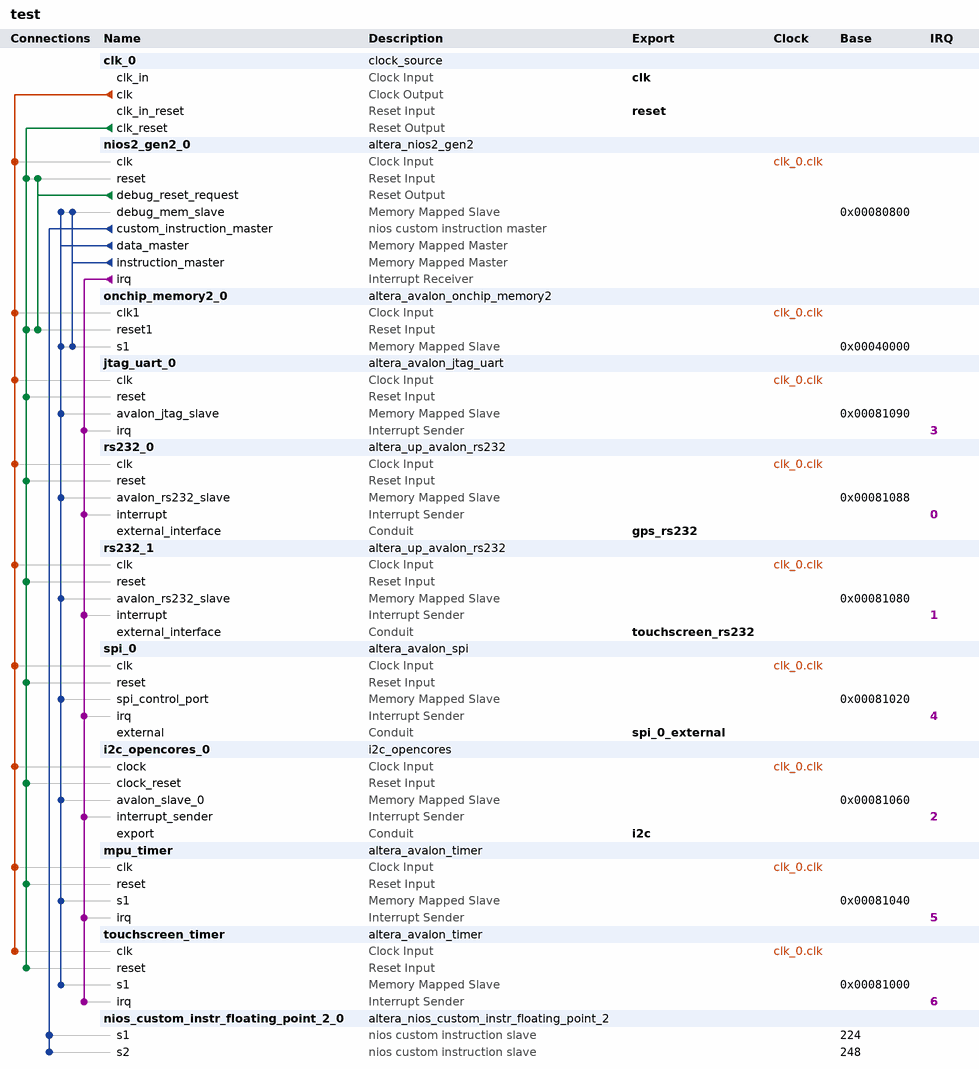
[diagram p0: system contents]
# Platform Designer (Qsys) system test, Cyclone V 5CSEMA5F31C6
# Parameters at their usual value, and those the tool derives, are not listed.
package require -exact qsys 18.1
create_system test
set_project_property DEVICE_FAMILY {Cyclone V}
set_project_property DEVICE 5CSEMA5F31C6

add_instance clk_0 clock_source 18.1
set_instance_parameter_value clk_0 clockFrequency 50000000

add_instance nios2_gen2_0 altera_nios2_gen2 18.1
set_instance_parameter_value nios2_gen2_0 dcache_size 2048
set_instance_parameter_value nios2_gen2_0 exceptionSlave onchip_memory2_0.s1
set_instance_parameter_value nios2_gen2_0 icache_size 4096
set_instance_parameter_value nios2_gen2_0 impl Tiny
set_instance_parameter_value nios2_gen2_0 resetSlave onchip_memory2_0.s1

add_instance onchip_memory2_0 altera_avalon_onchip_memory2 18.1
set_instance_parameter_value onchip_memory2_0 dataWidth 32
set_instance_parameter_value onchip_memory2_0 dualPort false
set_instance_parameter_value onchip_memory2_0 initMemContent true
set_instance_parameter_value onchip_memory2_0 initializationFileName onchip_mem.hex
set_instance_parameter_value onchip_memory2_0 memorySize 250000

add_instance jtag_uart_0 altera_avalon_jtag_uart 18.1
set_instance_parameter_value jtag_uart_0 simInteractiveOptions NO_INTERACTIVE_WINDOWS

add_instance rs232_0 altera_up_avalon_rs232 17.1
set_instance_parameter_value rs232_0 baud 9600
set_instance_parameter_value rs232_0 parity None

add_instance rs232_1 altera_up_avalon_rs232 17.1
set_instance_parameter_value rs232_1 baud 9600
set_instance_parameter_value rs232_1 parity None

add_instance spi_0 altera_avalon_spi 18.1
set_instance_parameter_value spi_0 clockPolarity 0
set_instance_parameter_value spi_0 dataWidth 8
set_instance_parameter_value spi_0 insertDelayBetweenSlaveSelectAndSClk true
set_instance_parameter_value spi_0 masterSPI true
set_instance_parameter_value spi_0 numberOfSlaves 1
set_instance_parameter_value spi_0 targetClockRate 128000
set_instance_parameter_value spi_0 targetSlaveSelectToSClkDelay 9.0

add_instance i2c_opencores_0 i2c_opencores 13.0

add_instance mpu_timer altera_avalon_timer 18.1
set_instance_parameter_value mpu_timer period 1
set_instance_parameter_value mpu_timer periodUnits MSEC

add_instance touchscreen_timer altera_avalon_timer 18.1
set_instance_parameter_value touchscreen_timer period 10
set_instance_parameter_value touchscreen_timer periodUnits MSEC

add_instance nios_custom_instr_floating_point_2_0 altera_nios_custom_instr_floating_point_2 18.1
set_instance_parameter_value nios_custom_instr_floating_point_2_0 arithmetic_present true
set_instance_parameter_value nios_custom_instr_floating_point_2_0 comparison_present true
set_instance_parameter_value nios_custom_instr_floating_point_2_0 conversion_present true
set_instance_parameter_value nios_custom_instr_floating_point_2_0 root_present true

# connections
add_connection clk_0.clk i2c_opencores_0.clock clock
add_connection clk_0.clk jtag_uart_0.clk clock
add_connection clk_0.clk mpu_timer.clk clock
add_connection clk_0.clk nios2_gen2_0.clk clock
add_connection clk_0.clk onchip_memory2_0.clk1 clock
add_connection clk_0.clk rs232_0.clk clock
add_connection clk_0.clk rs232_1.clk clock
add_connection clk_0.clk spi_0.clk clock
add_connection clk_0.clk touchscreen_timer.clk clock
add_connection clk_0.clk_reset i2c_opencores_0.clock_reset reset
add_connection clk_0.clk_reset jtag_uart_0.reset reset
add_connection clk_0.clk_reset mpu_timer.reset reset
add_connection clk_0.clk_reset nios2_gen2_0.reset reset
add_connection clk_0.clk_reset onchip_memory2_0.reset1 reset
add_connection clk_0.clk_reset rs232_0.reset reset
add_connection clk_0.clk_reset rs232_1.reset reset
add_connection clk_0.clk_reset spi_0.reset reset
add_connection clk_0.clk_reset touchscreen_timer.reset reset
add_connection nios2_gen2_0.debug_reset_request nios2_gen2_0.reset reset
add_connection nios2_gen2_0.debug_reset_request onchip_memory2_0.reset1 reset
add_connection nios2_gen2_0.data_master i2c_opencores_0.avalon_slave_0 avalon
set_connection_parameter_value nios2_gen2_0.data_master/i2c_opencores_0.avalon_slave_0 baseAddress 0x00081060
add_connection nios2_gen2_0.data_master jtag_uart_0.avalon_jtag_slave avalon
set_connection_parameter_value nios2_gen2_0.data_master/jtag_uart_0.avalon_jtag_slave baseAddress 0x00081090
add_connection nios2_gen2_0.data_master mpu_timer.s1 avalon
set_connection_parameter_value nios2_gen2_0.data_master/mpu_timer.s1 baseAddress 0x00081040
add_connection nios2_gen2_0.data_master nios2_gen2_0.debug_mem_slave avalon
set_connection_parameter_value nios2_gen2_0.data_master/nios2_gen2_0.debug_mem_slave baseAddress 0x00080800
add_connection nios2_gen2_0.data_master onchip_memory2_0.s1 avalon
set_connection_parameter_value nios2_gen2_0.data_master/onchip_memory2_0.s1 baseAddress 0x00040000
add_connection nios2_gen2_0.data_master rs232_0.avalon_rs232_slave avalon
set_connection_parameter_value nios2_gen2_0.data_master/rs232_0.avalon_rs232_slave baseAddress 0x00081088
add_connection nios2_gen2_0.data_master rs232_1.avalon_rs232_slave avalon
set_connection_parameter_value nios2_gen2_0.data_master/rs232_1.avalon_rs232_slave baseAddress 0x00081080
add_connection nios2_gen2_0.data_master spi_0.spi_control_port avalon
set_connection_parameter_value nios2_gen2_0.data_master/spi_0.spi_control_port baseAddress 0x00081020
add_connection nios2_gen2_0.data_master touchscreen_timer.s1 avalon
set_connection_parameter_value nios2_gen2_0.data_master/touchscreen_timer.s1 baseAddress 0x00081000
add_connection nios2_gen2_0.instruction_master nios2_gen2_0.debug_mem_slave avalon
set_connection_parameter_value nios2_gen2_0.instruction_master/nios2_gen2_0.debug_mem_slave baseAddress 0x00080800
add_connection nios2_gen2_0.instruction_master onchip_memory2_0.s1 avalon
set_connection_parameter_value nios2_gen2_0.instruction_master/onchip_memory2_0.s1 baseAddress 0x00040000
add_connection nios2_gen2_0.irq i2c_opencores_0.interrupt_sender interrupt
set_connection_parameter_value nios2_gen2_0.irq/i2c_opencores_0.interrupt_sender irqNumber 2
add_connection nios2_gen2_0.irq jtag_uart_0.irq interrupt
set_connection_parameter_value nios2_gen2_0.irq/jtag_uart_0.irq irqNumber 3
add_connection nios2_gen2_0.irq mpu_timer.irq interrupt
set_connection_parameter_value nios2_gen2_0.irq/mpu_timer.irq irqNumber 5
add_connection nios2_gen2_0.irq rs232_0.interrupt interrupt
set_connection_parameter_value nios2_gen2_0.irq/rs232_0.interrupt irqNumber 0
add_connection nios2_gen2_0.irq rs232_1.interrupt interrupt
set_connection_parameter_value nios2_gen2_0.irq/rs232_1.interrupt irqNumber 1
add_connection nios2_gen2_0.irq spi_0.irq interrupt
set_connection_parameter_value nios2_gen2_0.irq/spi_0.irq irqNumber 4
add_connection nios2_gen2_0.irq touchscreen_timer.irq interrupt
set_connection_parameter_value nios2_gen2_0.irq/touchscreen_timer.irq irqNumber 6
add_connection nios2_gen2_0.custom_instruction_master nios_custom_instr_floating_point_2_0.s1 nios_custom_instruction
set_connection_parameter_value nios2_gen2_0.custom_instruction_master/nios_custom_instr_floating_point_2_0.s1 CIName nios_custom_instr_floating_point_2_0
set_connection_parameter_value nios2_gen2_0.custom_instruction_master/nios_custom_instr_floating_point_2_0.s1 baseAddress 224
add_connection nios2_gen2_0.custom_instruction_master nios_custom_instr_floating_point_2_0.s2 nios_custom_instruction
set_connection_parameter_value nios2_gen2_0.custom_instruction_master/nios_custom_instr_floating_point_2_0.s2 CIName nios_custom_instr_floating_point_2_0_1
set_connection_parameter_value nios2_gen2_0.custom_instruction_master/nios_custom_instr_floating_point_2_0.s2 baseAddress 248

# exported interfaces
add_interface clk clock sink
set_interface_property clk EXPORT_OF clk_0.clk_in
add_interface gps_rs232 conduit end
set_interface_property gps_rs232 EXPORT_OF rs232_0.external_interface
add_interface i2c conduit end
set_interface_property i2c EXPORT_OF i2c_opencores_0.export
add_interface reset reset sink
set_interface_property reset EXPORT_OF clk_0.clk_in_reset
add_interface spi_0_external conduit end
set_interface_property spi_0_external EXPORT_OF spi_0.external
add_interface touchscreen_rs232 conduit end
set_interface_property touchscreen_rs232 EXPORT_OF rs232_1.external_interface

set_interconnect_requirement {$system} qsys_mm.clockCrossingAdapter HANDSHAKE
set_interconnect_requirement {$system} qsys_mm.enableEccProtection FALSE
set_interconnect_requirement {$system} qsys_mm.insertDefaultSlave FALSE
set_interconnect_requirement {$system} qsys_mm.maxAdditionalLatency 1

save_system test.qsys
